# Altium schematic sheet power_1.schdoc
size 297 x 209 mm; Symbol: Drawing-Symbol_A4; @Project Name: Odin; @Page Count: 9; @Update Date: 2025-12-16; @Create Date: 2025-12-15; @Schematic Name: Odin; @Page No: 3; @Page Name: power_1; Company: EasyEDA.com; Version: V1.0; Page Size: A4; @Create Time: 16:40:53; @Update Time: 15:31:15; Border: 1; Width: 1170; Height: 825; Region Start: 1; X Region Count: 6; Y Region Count: 4; Blade Width: 10; Title Block Position: 3; @Board Name: Odin_V1.0.0; Device: Drawing-Symbol_A4
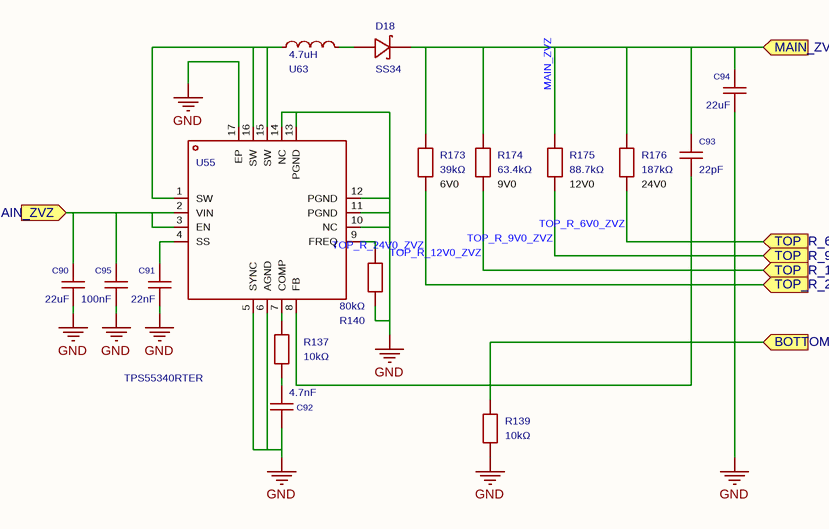
[diagram p0: power_1.schdoc]

## Parts
C90  22uF  [C0603]
C91  22nF  [C0603]
C92  4.7nF  [C0603]
C93  22pF  [C0603]
C94  22uF  [C0603]
C95  100nF  [C0603]
D18  SS34  [SMA_L4.3-W2.6-LS5.2-RD]
R137  10kΩ  [R0402]
R139  10kΩ  [R0402]
R140  80kΩ  [R0402]
R173  39kΩ  [R0402]
R174  63.4kΩ  [R0402]
R175  88.7kΩ  [R0402]
R176  187kΩ  [R0402]
U55  TPS55340RTER  [VQFN-16_L3.0-W3.0-P0.50-BL-EP1.7]
U63  4.7uH  [IND-SMD_L2.5-W2.0_YXMBL252010P]

## Ports
BOTTOM_R_ZVZ (in), MAIN_ZVZ (in), TOP_R_6V0_ZVZ (in), TOP_R_9V0_ZVZ (in), TOP_R_12V0_ZVZ (in), TOP_R_24V0_ZVZ (in)

## Nets
GND: C90.1 C91.1 C92.1 C94.1 C95.1 R139.2 R140.2 U55.5(SYNC) U55.6(AGND) U55.10(NC) U55.11(PGND) U55.12(PGND) U55.13(PGND) U55.14(NC) U55.17(EP)
BOTTOM_R_ZVZ: C93.1 R139.1 U55.8(FB) ; port BOTTOM_R_ZVZ
MAIN_ZVZ: C90.2 C93.2 C94.2 C95.2 D18.1(K) R173.1 R174.1 R175.1 R176.1 U55.2(VIN) U55.3(EN) ; port MAIN_ZVZ
TOP_R_6V0_ZVZ: R176.2 ; port TOP_R_6V0_ZVZ
TOP_R_9V0_ZVZ: R175.2 ; port TOP_R_9V0_ZVZ
TOP_R_12V0_ZVZ: R174.2 ; port TOP_R_12V0_ZVZ
TOP_R_24V0_ZVZ: R173.2 ; port TOP_R_24V0_ZVZ
NetC91_2: C91.2 U55.4(SS)
NetC92_2: C92.2 R137.2
NetD18_2: D18.2(A) U63.2
NetR137_1: R137.1 U55.7(COMP)
NetR140_1: R140.1 U55.9(FREQ)
NetU55_1: U55.1(SW) U55.15(SW) U55.16(SW) U63.1

## Notes on the sheet
- (near R173) 6V0
- (near R174) 9V0
- (near R175) 12V0
- (near R176) 24V0
- Create at
- 2025-12-15
- Schematic
- Board
- Odin
- Odin_V1.0.0
- Update at
- Page
- 2025-12-16
- power_1
- Drawn
- Reviewed
- Version
- V1.0
- Size
- A4
- Page  3  Total  9
- EasyEDA.com

## Library data of the parts
C90-C95 = CL10B223KB8NNNC: Capacitance:22nF Tolerance:±10% Tolerance:±10% Voltage Rating:50V Temperature Coefficient:X7R; Manufacturer: SAMSUNG(三星); AddInBom: yes; ModelId: 624118aa3cc7497086c383c2d72e0852; ModelName: C0603_L1.6-W0.8-H0.8; ModelTransform: 62.992,31.496,0,0,0,0,0,0,0; Tolerance: ±10%; Voltage Rating: 50V; Temperature Coefficient: X7R; Symbol: CL10B223KB8NNNC; Device: CL10B223KB8NNNC; Supplier: LCSC; Manufacturer Part: CL10B223KB8NNNC; JLCPCB Part Class: Basic Part; LCSC Part Name: 22nF ±10% 50V; Supplier Footprint: 0603; Datasheet: https://item.szlcsc.com/datasheet/CL10B223KB8NNNC/21834.html; ConvertToPcb: yes; FootprintName: C0603
  C90 C94: Value: 22uF
  C91: Value: 22nF
  C92: Value: 4.7nF
  C93: Value: 22pF
  C95: Value: 100nF
D18 = SS34_C8678: Diode Configuration:Independent Voltage - Forward(Vf@If):550mV@3A Voltage - DC Reverse(Vr):40V Current - Rectified:3A Reverse Leakage Current (Ir):500uA@40V Operating Junction Temperature Range:-55℃~+125℃ Operating Junction Temperature Range:-55℃~+125℃; Manufacturer: MDD(辰达半导体); AddInBom: yes; ModelId: e3551acb3c5a4975a5e9d36087fe1fa2; ModelTransform: 185.039,102.362,0,0,0,0,0,0,0; Voltage - DC Reverse(Vr): 40V; Current - Rectified: 3A; Symbol: SS34_C8678; Device: SS34_C8678; LCSC Part Name: 电压:40V 电流:3A; SupplierPart: C8678; ManufacturerPart: SS34; Supplier Footprint: SMA(DO-214AC); JLCPCB Part Class: Basic Part; Datasheet: https://item.szlcsc.com/datasheet/SS34/9178.html; Supplier: LCSC; ConvertToPcb: yes; FootprintName: SMA_L4.3-W2.6-LS5.2-RD; ModelName: SMA_L4.3-W2.6-LS5.2-RD; Diode Configuration: Independent; Voltage - Forward(Vf@If): 550mV@3A; Reverse Leakage Current (Ir): 500uA@40V; Operating Junction Temperature Range: -55℃~+125℃
R137 R139 R140 R173-R176 = FRC0402F3002TS: Type:Thick Film Resistor Resistance:30kΩ Tolerance:±1% Tolerance:±1% Power(Watts):62.5mW Voltage-Supply(Max):50V Temperature Coefficient:±100ppm/℃ Temperature Coefficient:±100ppm/℃ Operating Temperature:-55℃~+155℃ Operating Temperature:-55℃~+155℃; Manufacturer: FOJAN(富捷); AddInBom: yes; ModelId: efdecb7dae4442949d28eecaf748420f; ModelName: R0402_L1.0-W0.5-H0.4; ModelTransform: 39.37,19.685,0,0,0,0,0,0,0; Tolerance: ±1%; Power(Watts): 62.5mW; Voltage-Supply(Max): 50V; Symbol: FRC0402F3002TS; Device: FRC0402F3002TS; LCSC Part Name: 30kΩ ±1% 62.5mW 厚膜电阻; ManufacturerPart: FRC0402F3002TS; Supplier Footprint: 0402; JLCPCB Part Class: Extended Part; Supplier: LCSC; ConvertToPcb: yes; FootprintName: R0402; Type: Thick Film Resistor; Temperature Coefficient: ±100ppm/℃; Operating Temperature: -55℃~+155℃
  R137 R139: Value: 10kΩ
  R140: Value: 80kΩ
  R173: Value: 39kΩ
  R174: Value: 63.4kΩ
  R175: Value: 88.7kΩ
  R176: Value: 187kΩ
U55 = TPS55340RTER: Function:Boost type Output Type:Adjustable Voltage - Supply:2.9V~32V Voltage - Supply:2.9V~32V Output Voltage:2.9V~38V Output Voltage:2.9V~38V Output Current:5.25A Frequency - Switching:1.14MHz Frequency - Switching:1.14MHz Operating Temperature:-40℃~+125; Manufacturer: TI(德州仪器); AddInBom: yes; ModelId: 3b3cb15009254cdc9998a0afa903f75c; ModelTransform: 118.8974,118.8974,0,0,0,0,0,0,0; Output Current: 5.25A; Synchronous Rectifier: NONE; Number of Outputs: 1; Topology: Boost；SEPIC；Flyback; Switch tube (built-in/external): Built-in; Symbol: TPS55340RTER; Device: TPS55340RTER; LCSC Part Name: 5A 40V 非同步降压转换器; SupplierPart: C169167; ManufacturerPart: TPS55340RTER; Supplier Footprint: WQFN-16-EP(3x3); JLCPCB Part Class: Extended Part; Datasheet: https://www.ti.com/cn/lit/gpn/tps55340; Supplier: LCSC; ConvertToPcb: yes; FootprintName: VQFN-16_L3.0-W3.0-P0.50-BL-EP1.7; ModelName: VQFN-16_L3.0-W3.0-P0.50-BL-EP1.7; Function: Boost type; Output Type: Adjustable; Voltage - Supply: 2.9V~32V; Output Voltage: 2.9V~38V; Frequency - Switching: 1.14MHz; Operating Temperature: -40℃~+125℃@(TA); Quiescent Current: -
U63 = APH252010T2R2M: Inductance:2.2uH Tolerance:±20% Tolerance:±20% Current Rating:2.1A Current - Saturation(Isat):3A DC Resistance(DCR):70mΩ Type:Molded Inductor Ratings:-; Manufacturer: APV(爱普微); AddInBom: yes; ModelId: 4bd47527e6f04118aa3130d457affb74; ModelTransform: 99.2124,78.74,0,0,0,0,0,0,0; Tolerance: ±20%; Current Rating: 2.1A; Current - Saturation(Isat): 3A; DC Resistance(DCR): 70mΩ; Symbol: APH252010T2R2M; Value: 4.7uH; Device: APH252010T2R2M; LCSC Part Name: 2.2uH ±20% 3A 2.5x2x1mm; ManufacturerPart: APH252010T2R2M; Supplier Footprint: 1008; JLCPCB Part Class: Extended Part; Datasheet: https://item.szlcsc.com/datasheet/APH252010T2R2M/6135021.html; Supplier: LCSC; ConvertToPcb: yes; FootprintName: IND-SMD_L2.5-W2.0_YXMBL252010P; ModelName: IND-SMD_L2.5-W2.0_YXMBL252010P; Type: Molded Inductor; Ratings: -